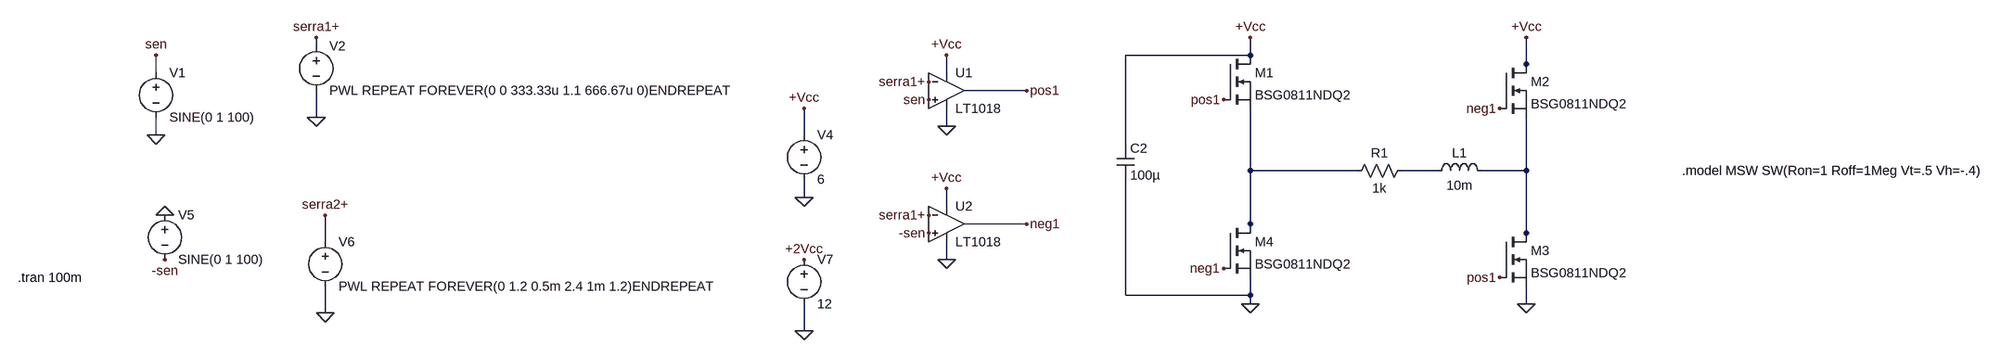
[diagram p0: schematic inversor.asc]
inversor.asc, the LTspice schematic file:
Version 4
SHEET 1 3964 1172
WIRE -160 64 -160 48
WIRE 2272 80 2272 48
WIRE 2272 80 2048 80
WIRE 2272 96 2272 80
WIRE 2768 96 2768 48
WIRE -448 112 -448 80
WIRE 1216 112 1216 80
WIRE 2768 112 2768 96
WIRE 1360 144 1248 144
WIRE -160 192 -160 144
WIRE 1216 208 1216 176
WIRE -448 224 -448 192
WIRE 960 224 960 176
WIRE 2048 240 2048 80
WIRE 2272 288 2272 176
WIRE 2464 288 2272 288
WIRE 2608 288 2544 288
WIRE 2768 288 2768 192
WIRE 2768 288 2688 288
WIRE 960 336 960 304
WIRE 1216 352 1216 320
WIRE 1360 384 1248 384
WIRE 2272 384 2272 288
WIRE 2272 400 2272 384
WIRE 2768 400 2768 288
WIRE -144 416 -144 368
WIRE 2768 416 2768 400
WIRE 1216 448 1216 416
WIRE 2048 512 2048 304
WIRE 2272 512 2272 480
WIRE 2272 512 2048 512
WIRE 2272 528 2272 512
WIRE 2768 528 2768 496
WIRE -144 544 -144 496
WIRE 960 576 960 528
FLAG -448 224 0
FLAG -448 80 sen
FLAG -160 192 0
FLAG -160 48 serra1+
FLAG 1216 208 0
FLAG 1216 448 0
FLAG 960 336 0
FLAG 960 176 +Vcc
FLAG 1184 160 sen
FLAG 1184 400 -sen
FLAG 1216 80 +Vcc
FLAG 1216 320 +Vcc
FLAG 1184 128 serra1+
FLAG 1184 368 serra1+
FLAG 1360 144 pos1
FLAG 2272 528 0
FLAG 2768 528 0
FLAG 2272 48 +Vcc
FLAG 2768 48 +Vcc
FLAG 2224 160 pos1
FLAG 2720 480 pos1
FLAG 2720 176 neg1
FLAG 2224 464 neg1
FLAG 1360 384 neg1
FLAG -432 448 -sen
FLAG -432 368 0
FLAG -144 544 0
FLAG -144 368 serra2+
FLAG 960 576 0
FLAG 960 448 +2Vcc
SYMBOL voltage -448 96 R0
WINDOW 123 0 0 Left 0
WINDOW 39 0 0 Left 0
SYMATTR InstName V1
SYMATTR Value SINE(0 1 100)
SYMBOL voltage -160 48 R0
WINDOW 123 0 0 Left 0
WINDOW 39 0 0 Left 0
SYMATTR InstName V2
SYMATTR Value PWL REPEAT FOREVER(0 0 333.33u 1.1 666.67u 0)ENDREPEAT
SYMBOL Comparators\\LT1018 1216 144 R0
SYMATTR InstName U1
SYMBOL voltage 960 208 R0
WINDOW 123 0 0 Left 0
WINDOW 39 0 0 Left 0
SYMATTR InstName V4
SYMATTR Value 6
SYMBOL Comparators\\LT1018 1216 384 R0
SYMATTR InstName U2
SYMBOL voltage -432 352 R0
WINDOW 123 0 0 Left 0
WINDOW 39 0 0 Left 0
SYMATTR InstName V5
SYMATTR Value SINE(0 1 100)
SYMBOL voltage -144 400 R0
WINDOW 123 0 0 Left 0
WINDOW 39 0 0 Left 0
SYMATTR InstName V6
SYMATTR Value PWL REPEAT FOREVER(0 1.2 0.5m 2.4 1m 1.2)ENDREPEAT
SYMBOL voltage 960 432 R0
WINDOW 123 0 0 Left 0
WINDOW 39 0 0 Left 0
SYMATTR InstName V7
SYMATTR Value 12
SYMBOL cap 2032 240 R0
SYMATTR InstName C2
SYMATTR Value 100µ
SYMBOL res 2560 272 R90
WINDOW 0 0 56 VBottom 2
WINDOW 3 32 56 VTop 2
SYMATTR InstName R1
SYMATTR Value 1k
SYMBOL ind 2592 304 R270
WINDOW 0 32 56 VTop 2
WINDOW 3 5 56 VBottom 2
SYMATTR InstName L1
SYMATTR Value 10m
SYMBOL nmos 2224 80 R0
SYMATTR InstName M1
SYMATTR Value BSG0811NDQ2
SYMBOL nmos 2720 96 R0
SYMATTR InstName M2
SYMATTR Value BSG0811NDQ2
SYMBOL nmos 2720 400 R0
SYMATTR InstName M3
SYMATTR Value BSG0811NDQ2
SYMBOL nmos 2224 384 R0
SYMATTR InstName M4
SYMATTR Value BSG0811NDQ2
TEXT -768 480 Left 2 !.tran 100m
TEXT 3376 288 Left 2 !.model MSW SW(Ron=1 Roff=1Meg Vt=.5 Vh=-.4)

The netlist it stands for:
* inversor.asc
V1 sen 0 SINE(0 1 100)
V2 serra1+ 0 PWL REPEAT FOREVER(0 0 333.33u 1.1 666.67u 0)ENDREPEAT
XU1 sen serra1+ +Vcc 0 pos1 LT1018  ; pins In+ In- V+ V- OUT
V4 +Vcc 0 6
XU2 -sen serra1+ +Vcc 0 neg1 LT1018  ; pins In+ In- V+ V- OUT
V5 0 -sen SINE(0 1 100)
V6 serra2+ 0 PWL REPEAT FOREVER(0 1.2 0.5m 2.4 1m 1.2)ENDREPEAT
V7 +2Vcc 0 12
C2 +Vcc 0 100µ
R1 N002 N001 1k
L1 N002 N003 10m
M1 +Vcc pos1 N001 N001 BSG0811NDQ2
M2 +Vcc neg1 N003 N003 BSG0811NDQ2
M3 N003 pos1 0 0 BSG0811NDQ2
M4 N001 neg1 0 0 BSG0811NDQ2
.model NMOS NMOS
.model PMOS PMOS
.lib standard.mos
.tran 100m
.model MSW SW(Ron=1 Roff=1Meg Vt=.5 Vh=-.4)
.lib LTC1.lib
.backanno
.end